# EAGLE schematic tempDAQ (EAGLE 8.3.0)

## Sheet 1 of 4
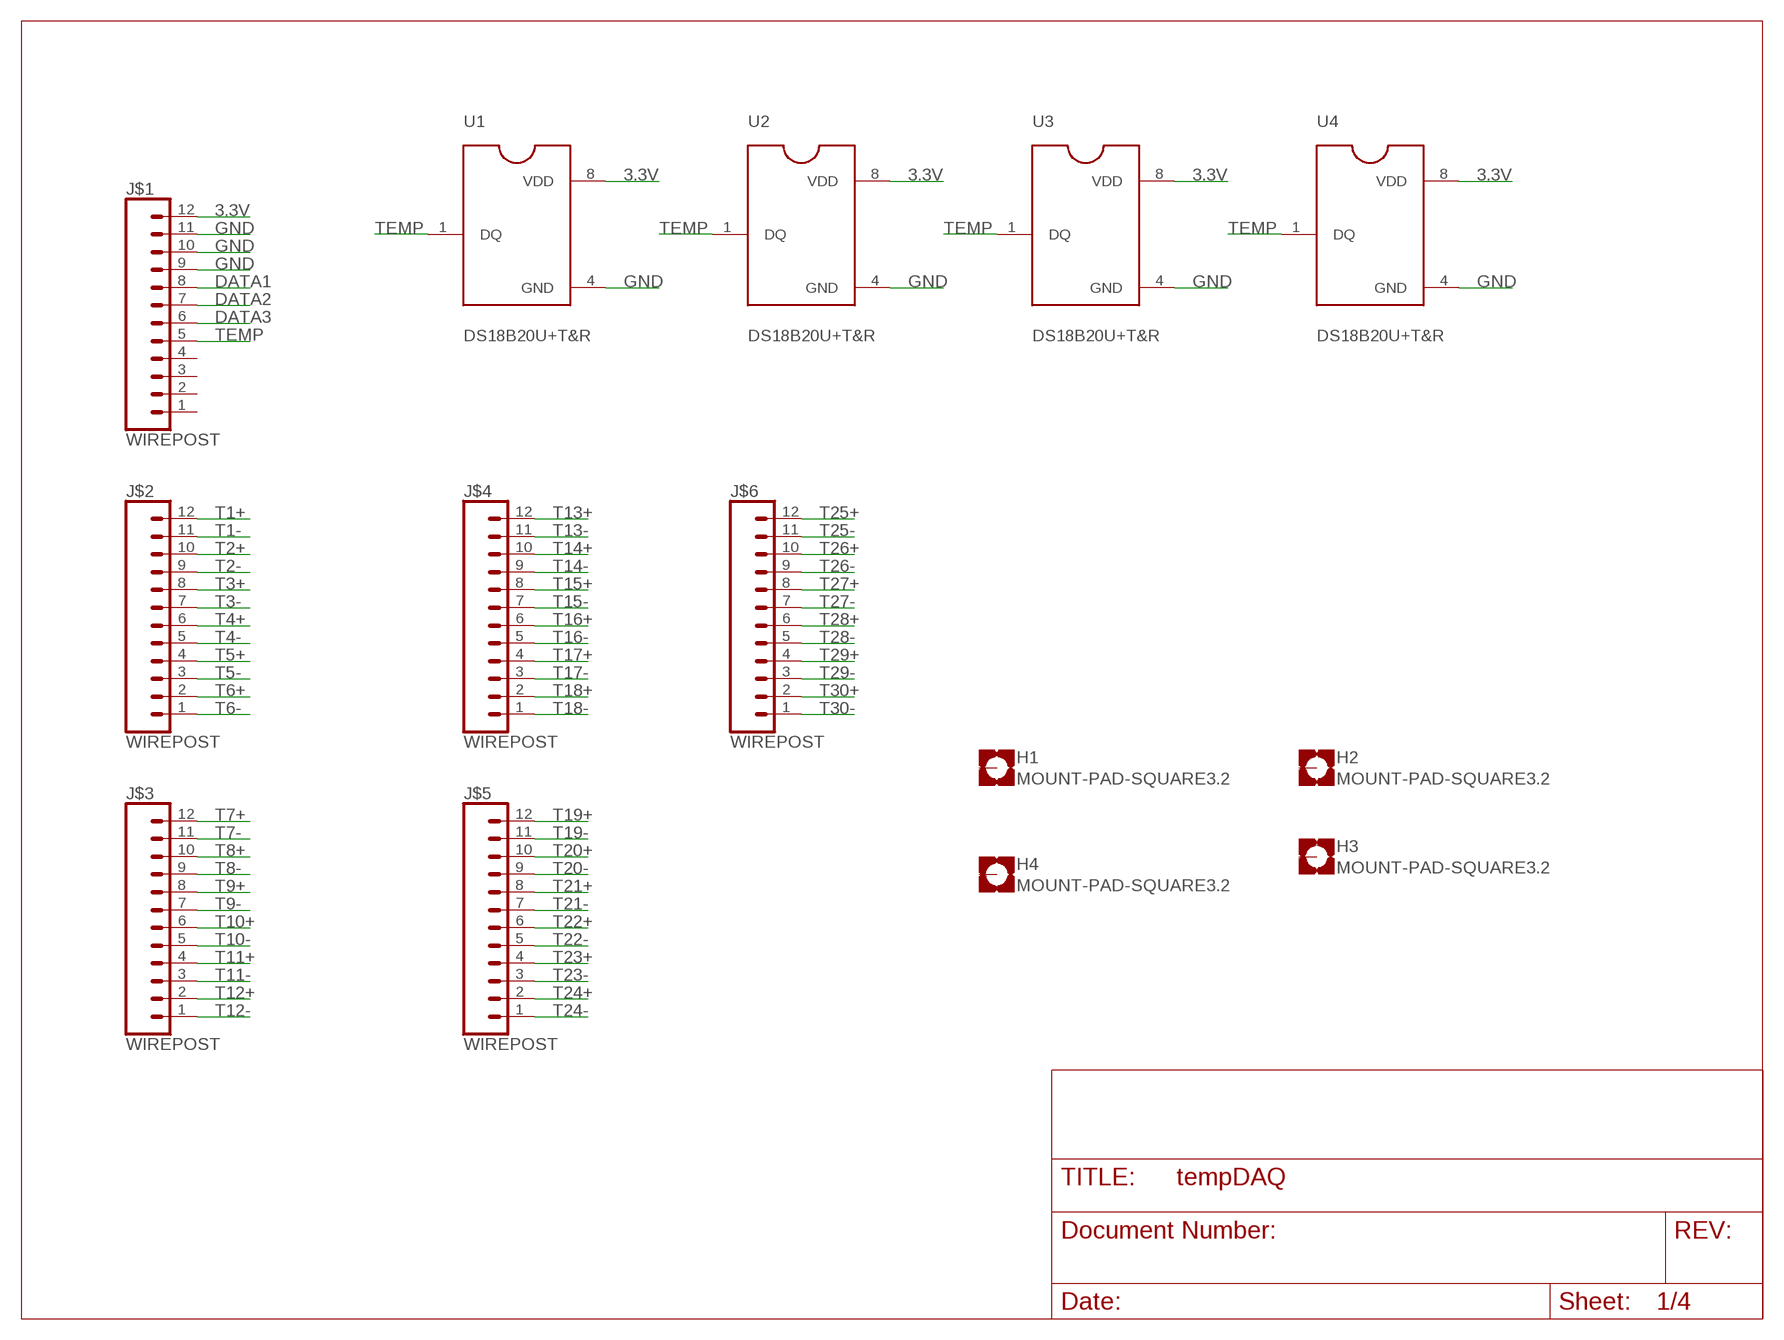
[diagram p0: schematic, sheet 1]

### Parts
H1  MOUNT-PAD-SQUARE3.2  [3,2-PAD-SQUARE]
H2  MOUNT-PAD-SQUARE3.2  [3,2-PAD-SQUARE]
H3  MOUNT-PAD-SQUARE3.2  [3,2-PAD-SQUARE]
H4  MOUNT-PAD-SQUARE3.2  [3,2-PAD-SQUARE]
J$1  WIREPOST  [WIREWRAPPOST]
J$2  WIREPOST  [WIREWRAPPOST]
J$3  WIREPOST  [WIREWRAPPOST]
J$4  WIREPOST  [WIREWRAPPOST]
J$5  WIREPOST  [WIREWRAPPOST]
J$6  WIREPOST  [WIREWRAPPOST]
U1  DS18B20U+T&R  [SOP65P500X110-8N]
U2  DS18B20U+T&R  [SOP65P500X110-8N]
U3  DS18B20U+T&R  [SOP65P500X110-8N]
U4  DS18B20U+T&R  [SOP65P500X110-8N]

### Nets
3.3V: J$1.12 U1.8(VDD) U2.8(VDD) U3.8(VDD) U4.8(VDD) ; also sheet 2,3,4
DATA1: J$1.8 ; also sheet 2
DATA2: J$1.7 ; also sheet 3
DATA3: J$1.6 ; also sheet 4
GND [gnd]: J$1.9 J$1.10 J$1.11 U1.4(GND) U2.4(GND) U3.4(GND) U4.4(GND) ; also sheet 2,3,4
T1+: J$2.12 ; also sheet 2
T1-: J$2.11 ; also sheet 2
T2+: J$2.10 ; also sheet 2
T2-: J$2.9 ; also sheet 2
T3+: J$2.8 ; also sheet 2
T3-: J$2.7 ; also sheet 2
T4+: J$2.6 ; also sheet 2
T4-: J$2.5 ; also sheet 2
T5+: J$2.4 ; also sheet 2
T5-: J$2.3 ; also sheet 2
T6+: J$2.2 ; also sheet 2
T6-: J$2.1 ; also sheet 2
T7+: J$3.12 ; also sheet 2
T7-: J$3.11 ; also sheet 2
T8+: J$3.10 ; also sheet 2
T8-: J$3.9 ; also sheet 2
T9+: J$3.8 ; also sheet 2
T9-: J$3.7 ; also sheet 2
T10+: J$3.6 ; also sheet 2
T10-: J$3.5 ; also sheet 2
T11+: J$3.4 ; also sheet 3
T11-: J$3.3 ; also sheet 3
T12+: J$3.2 ; also sheet 3
T12-: J$3.1 ; also sheet 3
T13+: J$4.12 ; also sheet 3
T13-: J$4.11 ; also sheet 3
T14+: J$4.10 ; also sheet 3
T14-: J$4.9 ; also sheet 3
T15+: J$4.8 ; also sheet 3
T15-: J$4.7 ; also sheet 3
T16+: J$4.6 ; also sheet 3
T16-: J$4.5 ; also sheet 3
T17+: J$4.4 ; also sheet 3
T17-: J$4.3 ; also sheet 3
T18+: J$4.2 ; also sheet 3
T18-: J$4.1 ; also sheet 3
T19+: J$5.12 ; also sheet 3
T19-: J$5.11 ; also sheet 3
T20+: J$5.10 ; also sheet 3
T20-: J$5.9 ; also sheet 3
T21+: J$5.8 ; also sheet 4
T21-: J$5.7 ; also sheet 4
T22+: J$5.6 ; also sheet 4
T22-: J$5.5 ; also sheet 4
T23+: J$5.4 ; also sheet 4
T23-: J$5.3 ; also sheet 4
T24+: J$5.2 ; also sheet 4
T24-: J$5.1 ; also sheet 4
T25+: J$6.12 ; also sheet 4
T25-: J$6.11 ; also sheet 4
T26+: J$6.10 ; also sheet 4
T26-: J$6.9 ; also sheet 4
T27+: J$6.8 ; also sheet 4
T27-: J$6.7 ; also sheet 4
T28+: J$6.6 ; also sheet 4
T28-: J$6.5 ; also sheet 4
T29+: J$6.4 ; also sheet 4
T29-: J$6.3 ; also sheet 4
T30+: J$6.2 ; also sheet 4
T30-: J$6.1 ; also sheet 4
TEMP: J$1.5 U1.1(DQ) U2.1(DQ) U3.1(DQ) U4.1(DQ)
Unconnected: H1.B3,2(MOUNT) H2.B3,2(MOUNT) H3.B3,2(MOUNT) H4.B3,2(MOUNT) J$1.1 J$1.2 J$1.3 J$1.4

## Sheet 2 of 4
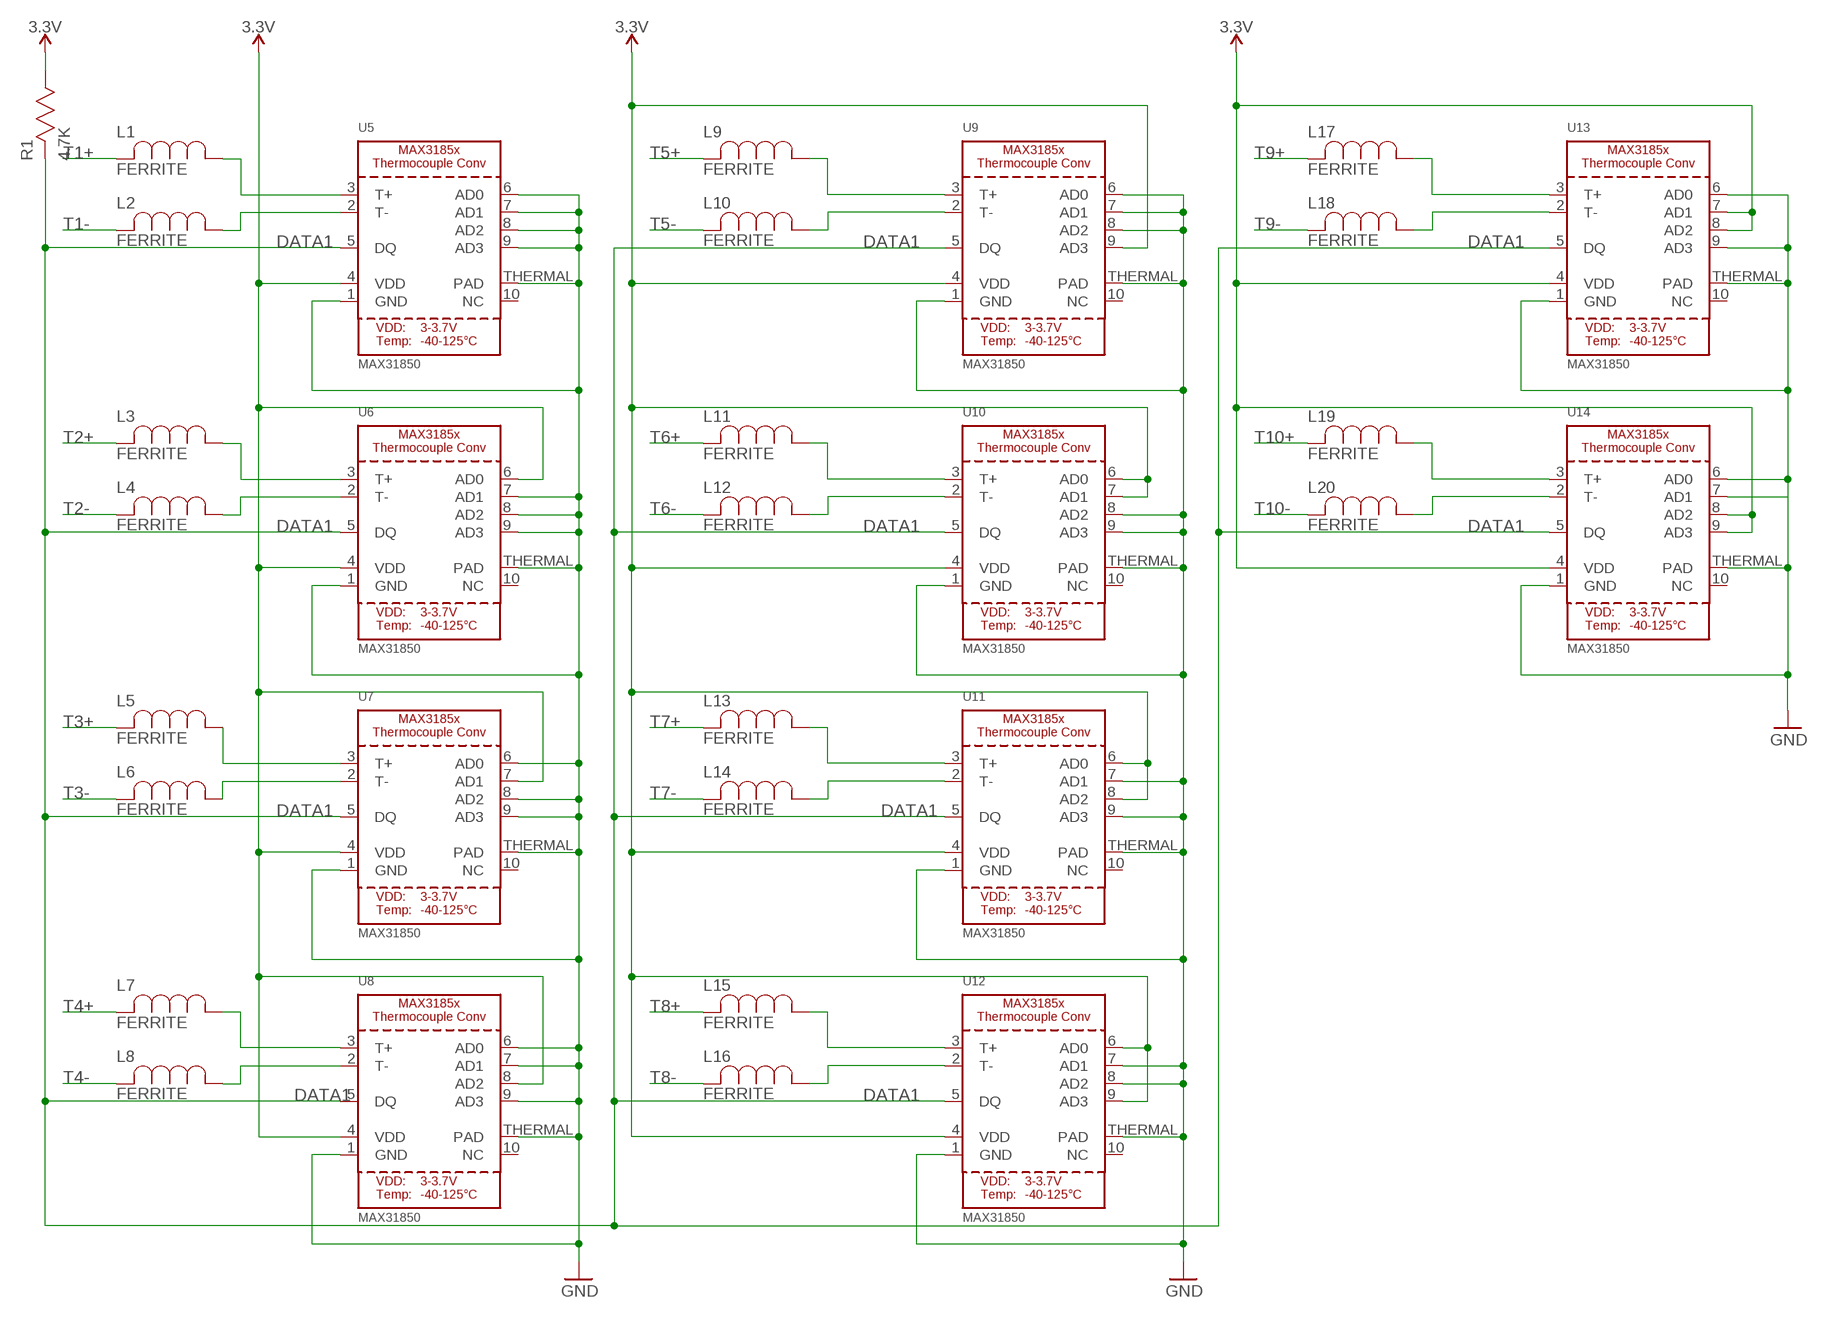
[diagram p1: schematic, sheet 2]

### Parts
L1  FERRITE  [IND_BOURNS_MH2029]
L2  FERRITE  [IND_BOURNS_MH2029]
L3  FERRITE  [IND_BOURNS_MH2029]
L4  FERRITE  [IND_BOURNS_MH2029]
L5  FERRITE  [IND_BOURNS_MH2029]
L6  FERRITE  [IND_BOURNS_MH2029]
L7  FERRITE  [IND_BOURNS_MH2029]
L8  FERRITE  [IND_BOURNS_MH2029]
L9  FERRITE  [IND_BOURNS_MH2029]
L10  FERRITE  [IND_BOURNS_MH2029]
L11  FERRITE  [IND_BOURNS_MH2029]
L12  FERRITE  [IND_BOURNS_MH2029]
L13  FERRITE  [IND_BOURNS_MH2029]
L14  FERRITE  [IND_BOURNS_MH2029]
L15  FERRITE  [IND_BOURNS_MH2029]
L16  FERRITE  [IND_BOURNS_MH2029]
L17  FERRITE  [IND_BOURNS_MH2029]
L18  FERRITE  [IND_BOURNS_MH2029]
L19  FERRITE  [IND_BOURNS_MH2029]
L20  FERRITE  [IND_BOURNS_MH2029]
R1  4.7K  RES_4_7K  [RC0603N]
U5  MAX31850  MAX3185X  [TDFN10_3X4MM]
U6  MAX31850  MAX3185X  [TDFN10_3X4MM]
U7  MAX31850  MAX3185X  [TDFN10_3X4MM]
U8  MAX31850  MAX3185X  [TDFN10_3X4MM]
U9  MAX31850  MAX3185X  [TDFN10_3X4MM]
U10  MAX31850  MAX3185X  [TDFN10_3X4MM]
U11  MAX31850  MAX3185X  [TDFN10_3X4MM]
U12  MAX31850  MAX3185X  [TDFN10_3X4MM]
U13  MAX31850  MAX3185X  [TDFN10_3X4MM]
U14  MAX31850  MAX3185X  [TDFN10_3X4MM]

### Nets
3.3V: R1.1 U5.4(VDD) U6.4(VDD) U6.6(AD0) U7.4(VDD) U7.7(AD1) U8.4(VDD) U8.8(AD2) U9.4(VDD) U9.9(AD3) U10.4(VDD) U10.6(AD0) U10.7(AD1) U11.4(VDD) U11.6(AD0) U11.8(AD2) U12.4(VDD) U12.6(AD0) U12.9(AD3) U13.4(VDD) U13.7(AD1) U13.8(AD2) U14.4(VDD) U14.8(AD2) U14.9(AD3) ; supply symbol labelled POWER_3.3V ; also sheet 1,3,4
DATA1: R1.2 U5.5(DQ) U6.5(DQ) U7.5(DQ) U8.5(DQ) U9.5(DQ) U10.5(DQ) U11.5(DQ) U12.5(DQ) U13.5(DQ) U14.5(DQ) ; also sheet 1
GND [gnd]: U5.1(GND) U5.6(AD0) U5.7(AD1) U5.8(AD2) U5.9(AD3) U5.THERMAL(PAD) U6.1(GND) U6.7(AD1) U6.8(AD2) U6.9(AD3) U6.THERMAL(PAD) U7.1(GND) U7.6(AD0) U7.8(AD2) U7.9(AD3) U7.THERMAL(PAD) U8.1(GND) U8.6(AD0) U8.7(AD1) U8.9(AD3) U8.THERMAL(PAD) U9.1(GND) U9.6(AD0) U9.7(AD1) U9.8(AD2) U9.THERMAL(PAD) U10.1(GND) U10.8(AD2) U10.9(AD3) U10.THERMAL(PAD) U11.1(GND) U11.7(AD1) U11.9(AD3) U11.THERMAL(PAD) U12.1(GND) U12.7(AD1) U12.8(AD2) U12.THERMAL(PAD) U13.1(GND) U13.6(AD0) U13.9(AD3) U13.THERMAL(PAD) U14.1(GND) U14.6(AD0) U14.7(AD1) U14.THERMAL(PAD) ; supply symbol labelled POWER_GND ; also sheet 1,3,4
N$17: L1.1 U5.3(T+)
N$22: L2.1 U5.2(T-)
N$23: L3.1 U6.3(T+)
N$24: L4.1 U6.2(T-)
N$25: L6.1 U7.2(T-)
N$26: L5.1 U7.3(T+)
N$27: L7.1 U8.3(T+)
N$28: L8.1 U8.2(T-)
N$29: L9.1 U9.3(T+)
N$30: L10.1 U9.2(T-)
N$31: L11.1 U10.3(T+)
N$32: L12.1 U10.2(T-)
N$33: L13.1 U11.3(T+)
N$34: L14.1 U11.2(T-)
N$35: L15.1 U12.3(T+)
N$36: L16.1 U12.2(T-)
N$37: L17.1 U13.3(T+)
N$38: L18.1 U13.2(T-)
N$39: L19.1 U14.3(T+)
N$40: L20.1 U14.2(T-)
T1+: L1.2 ; also sheet 1
T1-: L2.2 ; also sheet 1
T2+: L3.2 ; also sheet 1
T2-: L4.2 ; also sheet 1
T3+: L5.2 ; also sheet 1
T3-: L6.2 ; also sheet 1
T4+: L7.2 ; also sheet 1
T4-: L8.2 ; also sheet 1
T5+: L9.2 ; also sheet 1
T5-: L10.2 ; also sheet 1
T6+: L11.2 ; also sheet 1
T6-: L12.2 ; also sheet 1
T7+: L13.2 ; also sheet 1
T7-: L14.2 ; also sheet 1
T8+: L15.2 ; also sheet 1
T8-: L16.2 ; also sheet 1
T9+: L17.2 ; also sheet 1
T9-: L18.2 ; also sheet 1
T10+: L19.2 ; also sheet 1
T10-: L20.2 ; also sheet 1
Unconnected: U5.10(NC) U6.10(NC) U7.10(NC) U8.10(NC) U9.10(NC) U10.10(NC) U11.10(NC) U12.10(NC) U13.10(NC) U14.10(NC)

## Sheet 3 of 4
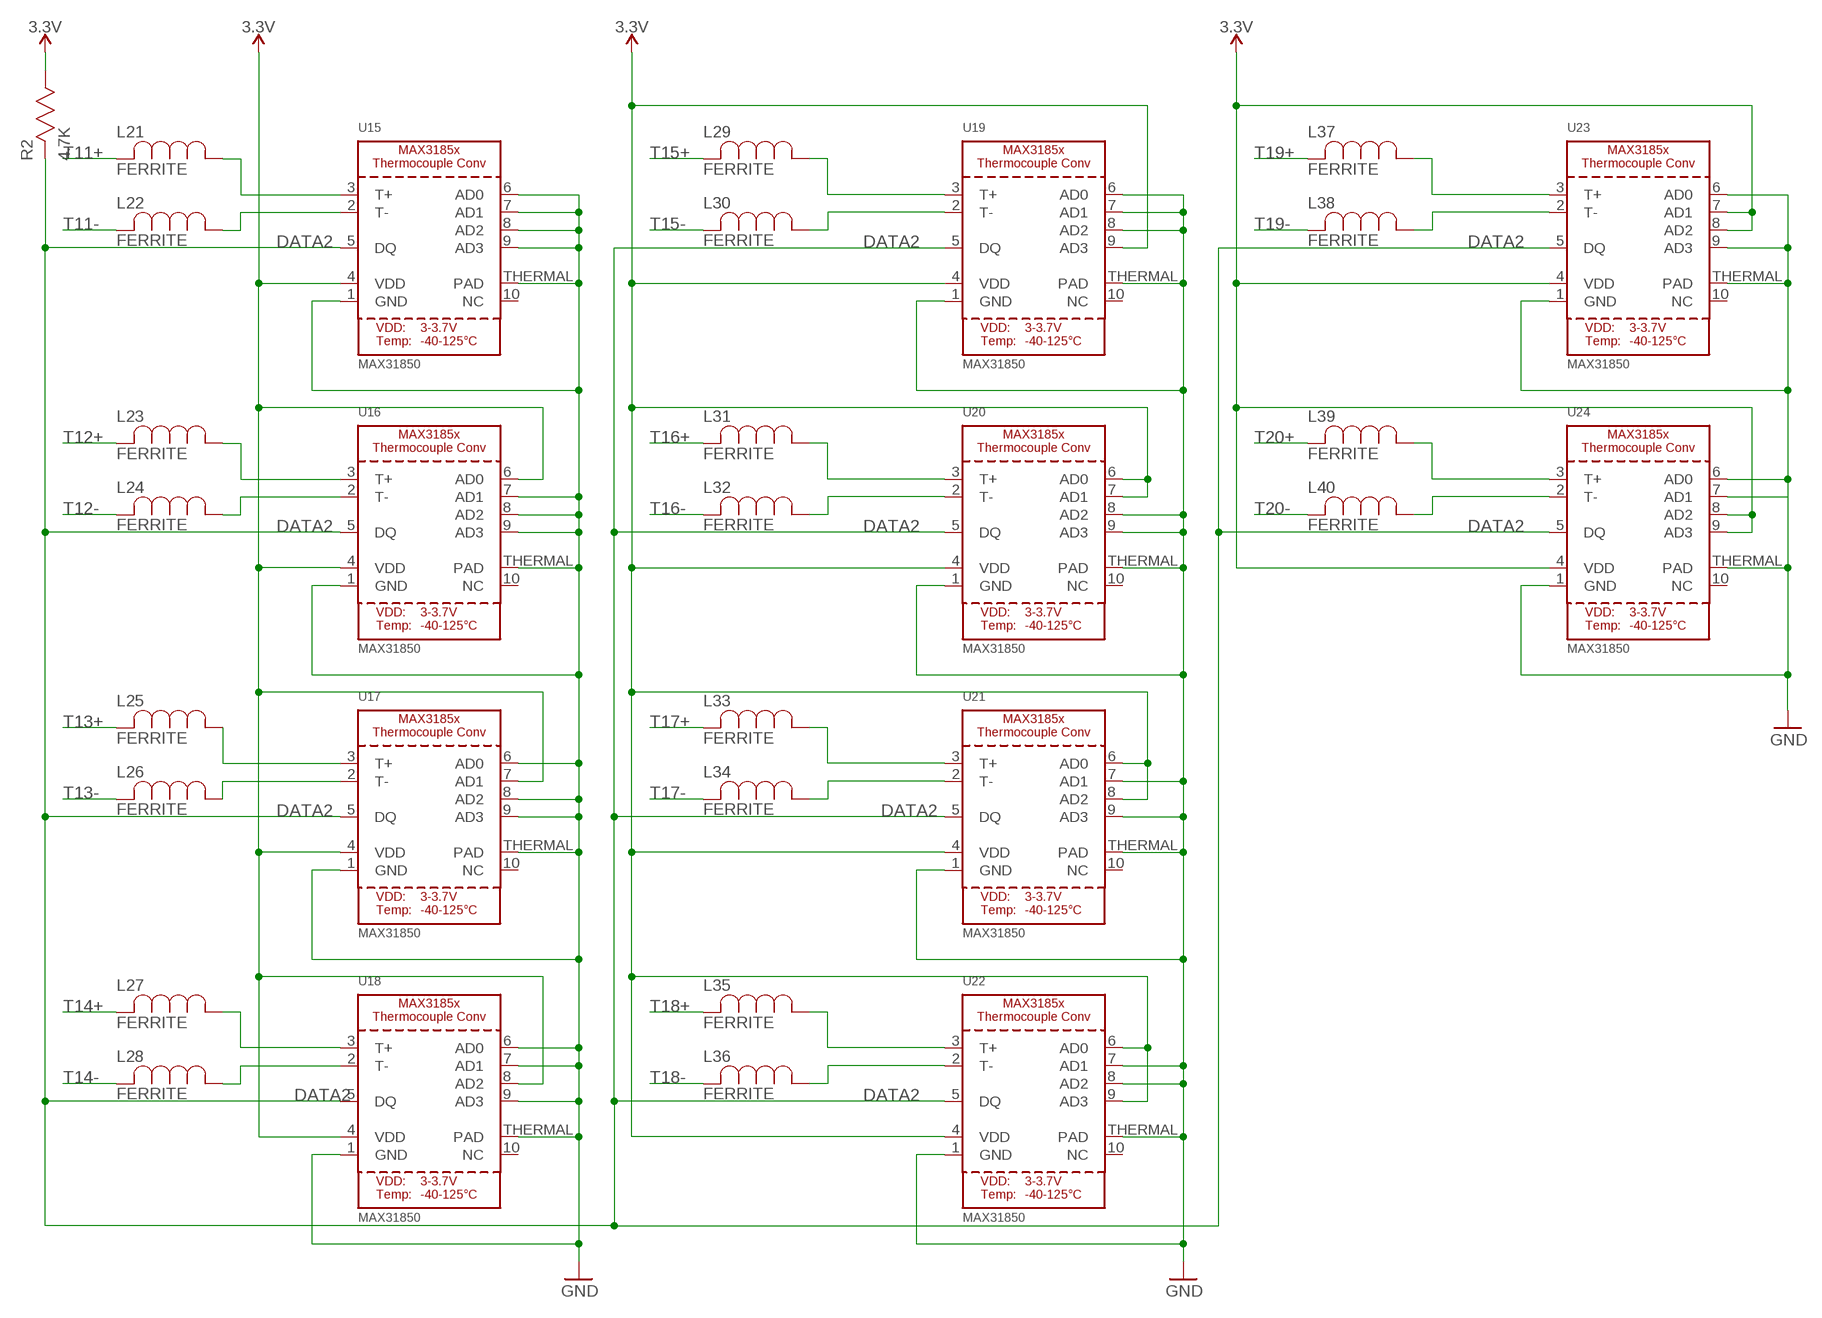
[diagram p2: schematic, sheet 3]

### Parts
L21  FERRITE  [IND_BOURNS_MH2029]
L22  FERRITE  [IND_BOURNS_MH2029]
L23  FERRITE  [IND_BOURNS_MH2029]
L24  FERRITE  [IND_BOURNS_MH2029]
L25  FERRITE  [IND_BOURNS_MH2029]
L26  FERRITE  [IND_BOURNS_MH2029]
L27  FERRITE  [IND_BOURNS_MH2029]
L28  FERRITE  [IND_BOURNS_MH2029]
L29  FERRITE  [IND_BOURNS_MH2029]
L30  FERRITE  [IND_BOURNS_MH2029]
L31  FERRITE  [IND_BOURNS_MH2029]
L32  FERRITE  [IND_BOURNS_MH2029]
L33  FERRITE  [IND_BOURNS_MH2029]
L34  FERRITE  [IND_BOURNS_MH2029]
L35  FERRITE  [IND_BOURNS_MH2029]
L36  FERRITE  [IND_BOURNS_MH2029]
L37  FERRITE  [IND_BOURNS_MH2029]
L38  FERRITE  [IND_BOURNS_MH2029]
L39  FERRITE  [IND_BOURNS_MH2029]
L40  FERRITE  [IND_BOURNS_MH2029]
R2  4.7K  RES_4_7K  [RC0603N]
U15  MAX31850  MAX3185X  [TDFN10_3X4MM]
U16  MAX31850  MAX3185X  [TDFN10_3X4MM]
U17  MAX31850  MAX3185X  [TDFN10_3X4MM]
U18  MAX31850  MAX3185X  [TDFN10_3X4MM]
U19  MAX31850  MAX3185X  [TDFN10_3X4MM]
U20  MAX31850  MAX3185X  [TDFN10_3X4MM]
U21  MAX31850  MAX3185X  [TDFN10_3X4MM]
U22  MAX31850  MAX3185X  [TDFN10_3X4MM]
U23  MAX31850  MAX3185X  [TDFN10_3X4MM]
U24  MAX31850  MAX3185X  [TDFN10_3X4MM]

### Nets
3.3V: R2.1 U15.4(VDD) U16.4(VDD) U16.6(AD0) U17.4(VDD) U17.7(AD1) U18.4(VDD) U18.8(AD2) U19.4(VDD) U19.9(AD3) U20.4(VDD) U20.6(AD0) U20.7(AD1) U21.4(VDD) U21.6(AD0) U21.8(AD2) U22.4(VDD) U22.6(AD0) U22.9(AD3) U23.4(VDD) U23.7(AD1) U23.8(AD2) U24.4(VDD) U24.8(AD2) U24.9(AD3) ; supply symbol labelled POWER_3.3V ; also sheet 1,2,4
DATA2: R2.2 U15.5(DQ) U16.5(DQ) U17.5(DQ) U18.5(DQ) U19.5(DQ) U20.5(DQ) U21.5(DQ) U22.5(DQ) U23.5(DQ) U24.5(DQ) ; also sheet 1
GND [gnd]: U15.1(GND) U15.6(AD0) U15.7(AD1) U15.8(AD2) U15.9(AD3) U15.THERMAL(PAD) U16.1(GND) U16.7(AD1) U16.8(AD2) U16.9(AD3) U16.THERMAL(PAD) U17.1(GND) U17.6(AD0) U17.8(AD2) U17.9(AD3) U17.THERMAL(PAD) U18.1(GND) U18.6(AD0) U18.7(AD1) U18.9(AD3) U18.THERMAL(PAD) U19.1(GND) U19.6(AD0) U19.7(AD1) U19.8(AD2) U19.THERMAL(PAD) U20.1(GND) U20.8(AD2) U20.9(AD3) U20.THERMAL(PAD) U21.1(GND) U21.7(AD1) U21.9(AD3) U21.THERMAL(PAD) U22.1(GND) U22.7(AD1) U22.8(AD2) U22.THERMAL(PAD) U23.1(GND) U23.6(AD0) U23.9(AD3) U23.THERMAL(PAD) U24.1(GND) U24.6(AD0) U24.7(AD1) U24.THERMAL(PAD) ; supply symbol labelled POWER_GND ; also sheet 1,2,4
N$1: L21.1 U15.3(T+)
N$2: L22.1 U15.2(T-)
N$3: L23.1 U16.3(T+)
N$4: L24.1 U16.2(T-)
N$5: L26.1 U17.2(T-)
N$6: L25.1 U17.3(T+)
N$7: L27.1 U18.3(T+)
N$8: L28.1 U18.2(T-)
N$9: L29.1 U19.3(T+)
N$10: L30.1 U19.2(T-)
N$11: L31.1 U20.3(T+)
N$12: L32.1 U20.2(T-)
N$13: L33.1 U21.3(T+)
N$14: L34.1 U21.2(T-)
N$15: L35.1 U22.3(T+)
N$16: L36.1 U22.2(T-)
N$18: L37.1 U23.3(T+)
N$19: L38.1 U23.2(T-)
N$20: L39.1 U24.3(T+)
N$21: L40.1 U24.2(T-)
T11+: L21.2 ; also sheet 1
T11-: L22.2 ; also sheet 1
T12+: L23.2 ; also sheet 1
T12-: L24.2 ; also sheet 1
T13+: L25.2 ; also sheet 1
T13-: L26.2 ; also sheet 1
T14+: L27.2 ; also sheet 1
T14-: L28.2 ; also sheet 1
T15+: L29.2 ; also sheet 1
T15-: L30.2 ; also sheet 1
T16+: L31.2 ; also sheet 1
T16-: L32.2 ; also sheet 1
T17+: L33.2 ; also sheet 1
T17-: L34.2 ; also sheet 1
T18+: L35.2 ; also sheet 1
T18-: L36.2 ; also sheet 1
T19+: L37.2 ; also sheet 1
T19-: L38.2 ; also sheet 1
T20+: L39.2 ; also sheet 1
T20-: L40.2 ; also sheet 1
Unconnected: U15.10(NC) U16.10(NC) U17.10(NC) U18.10(NC) U19.10(NC) U20.10(NC) U21.10(NC) U22.10(NC) U23.10(NC) U24.10(NC)

## Sheet 4 of 4
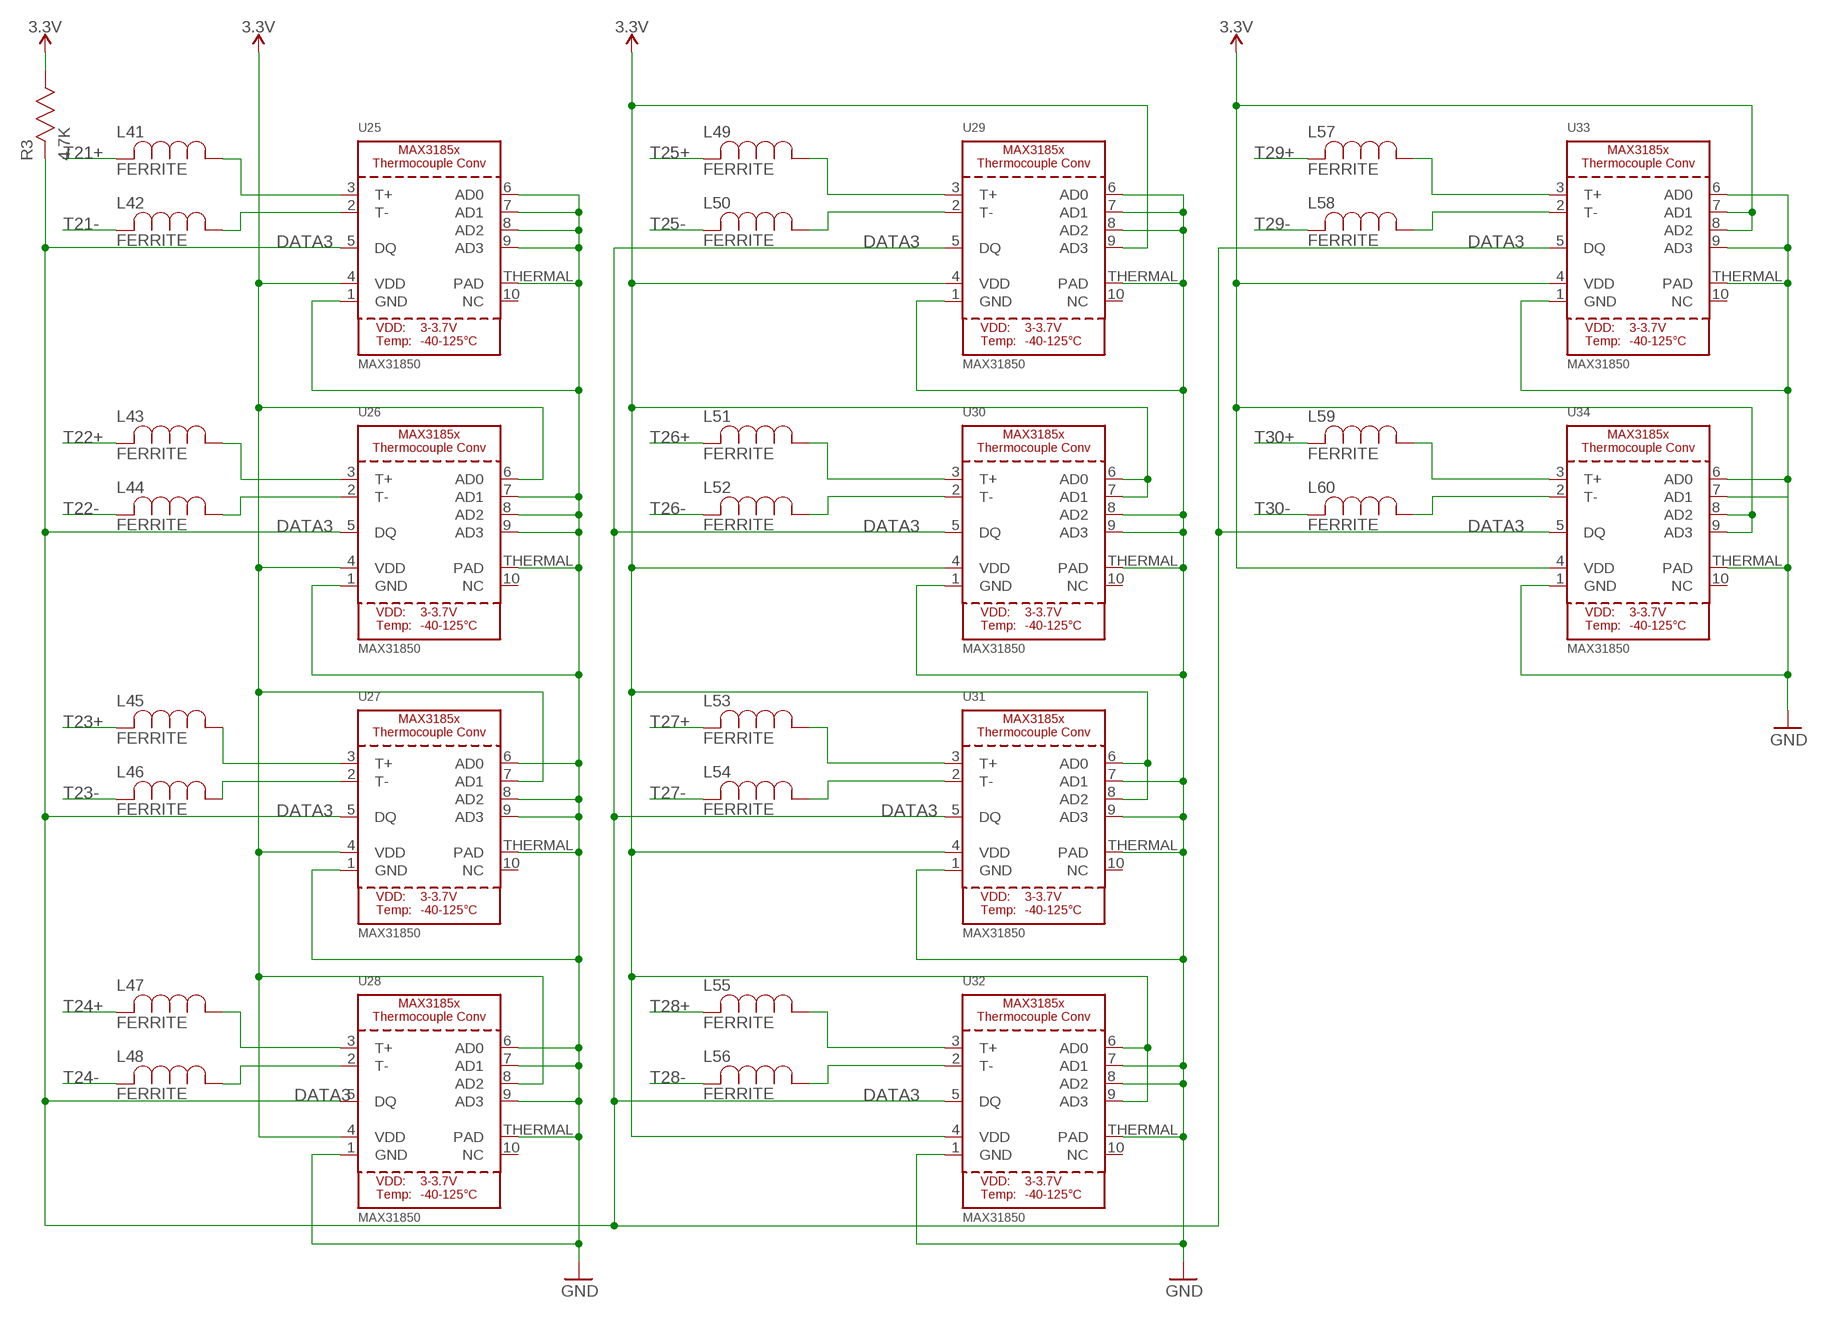
[diagram p3: schematic, sheet 4]

### Parts
L41  FERRITE  [IND_BOURNS_MH2029]
L42  FERRITE  [IND_BOURNS_MH2029]
L43  FERRITE  [IND_BOURNS_MH2029]
L44  FERRITE  [IND_BOURNS_MH2029]
L45  FERRITE  [IND_BOURNS_MH2029]
L46  FERRITE  [IND_BOURNS_MH2029]
L47  FERRITE  [IND_BOURNS_MH2029]
L48  FERRITE  [IND_BOURNS_MH2029]
L49  FERRITE  [IND_BOURNS_MH2029]
L50  FERRITE  [IND_BOURNS_MH2029]
L51  FERRITE  [IND_BOURNS_MH2029]
L52  FERRITE  [IND_BOURNS_MH2029]
L53  FERRITE  [IND_BOURNS_MH2029]
L54  FERRITE  [IND_BOURNS_MH2029]
L55  FERRITE  [IND_BOURNS_MH2029]
L56  FERRITE  [IND_BOURNS_MH2029]
L57  FERRITE  [IND_BOURNS_MH2029]
L58  FERRITE  [IND_BOURNS_MH2029]
L59  FERRITE  [IND_BOURNS_MH2029]
L60  FERRITE  [IND_BOURNS_MH2029]
R3  4.7K  RES_4_7K  [RC0603N]
U25  MAX31850  MAX3185X  [TDFN10_3X4MM]
U26  MAX31850  MAX3185X  [TDFN10_3X4MM]
U27  MAX31850  MAX3185X  [TDFN10_3X4MM]
U28  MAX31850  MAX3185X  [TDFN10_3X4MM]
U29  MAX31850  MAX3185X  [TDFN10_3X4MM]
U30  MAX31850  MAX3185X  [TDFN10_3X4MM]
U31  MAX31850  MAX3185X  [TDFN10_3X4MM]
U32  MAX31850  MAX3185X  [TDFN10_3X4MM]
U33  MAX31850  MAX3185X  [TDFN10_3X4MM]
U34  MAX31850  MAX3185X  [TDFN10_3X4MM]

### Nets
3.3V: R3.1 U25.4(VDD) U26.4(VDD) U26.6(AD0) U27.4(VDD) U27.7(AD1) U28.4(VDD) U28.8(AD2) U29.4(VDD) U29.9(AD3) U30.4(VDD) U30.6(AD0) U30.7(AD1) U31.4(VDD) U31.6(AD0) U31.8(AD2) U32.4(VDD) U32.6(AD0) U32.9(AD3) U33.4(VDD) U33.7(AD1) U33.8(AD2) U34.4(VDD) U34.8(AD2) U34.9(AD3) ; supply symbol labelled POWER_3.3V ; also sheet 1,2,3
DATA3: R3.2 U25.5(DQ) U26.5(DQ) U27.5(DQ) U28.5(DQ) U29.5(DQ) U30.5(DQ) U31.5(DQ) U32.5(DQ) U33.5(DQ) U34.5(DQ) ; also sheet 1
GND [gnd]: U25.1(GND) U25.6(AD0) U25.7(AD1) U25.8(AD2) U25.9(AD3) U25.THERMAL(PAD) U26.1(GND) U26.7(AD1) U26.8(AD2) U26.9(AD3) U26.THERMAL(PAD) U27.1(GND) U27.6(AD0) U27.8(AD2) U27.9(AD3) U27.THERMAL(PAD) U28.1(GND) U28.6(AD0) U28.7(AD1) U28.9(AD3) U28.THERMAL(PAD) U29.1(GND) U29.6(AD0) U29.7(AD1) U29.8(AD2) U29.THERMAL(PAD) U30.1(GND) U30.8(AD2) U30.9(AD3) U30.THERMAL(PAD) U31.1(GND) U31.7(AD1) U31.9(AD3) U31.THERMAL(PAD) U32.1(GND) U32.7(AD1) U32.8(AD2) U32.THERMAL(PAD) U33.1(GND) U33.6(AD0) U33.9(AD3) U33.THERMAL(PAD) U34.1(GND) U34.6(AD0) U34.7(AD1) U34.THERMAL(PAD) ; supply symbol labelled POWER_GND ; also sheet 1,2,3
N$41: L41.1 U25.3(T+)
N$42: L42.1 U25.2(T-)
N$43: L43.1 U26.3(T+)
N$44: L44.1 U26.2(T-)
N$45: L46.1 U27.2(T-)
N$46: L45.1 U27.3(T+)
N$47: L47.1 U28.3(T+)
N$48: L48.1 U28.2(T-)
N$49: L49.1 U29.3(T+)
N$50: L50.1 U29.2(T-)
N$51: L51.1 U30.3(T+)
N$52: L52.1 U30.2(T-)
N$53: L53.1 U31.3(T+)
N$54: L54.1 U31.2(T-)
N$55: L55.1 U32.3(T+)
N$56: L56.1 U32.2(T-)
N$57: L57.1 U33.3(T+)
N$58: L58.1 U33.2(T-)
N$59: L59.1 U34.3(T+)
N$60: L60.1 U34.2(T-)
T21+: L41.2 ; also sheet 1
T21-: L42.2 ; also sheet 1
T22+: L43.2 ; also sheet 1
T22-: L44.2 ; also sheet 1
T23+: L45.2 ; also sheet 1
T23-: L46.2 ; also sheet 1
T24+: L47.2 ; also sheet 1
T24-: L48.2 ; also sheet 1
T25+: L49.2 ; also sheet 1
T25-: L50.2 ; also sheet 1
T26+: L51.2 ; also sheet 1
T26-: L52.2 ; also sheet 1
T27+: L53.2 ; also sheet 1
T27-: L54.2 ; also sheet 1
T28+: L55.2 ; also sheet 1
T28-: L56.2 ; also sheet 1
T29+: L57.2 ; also sheet 1
T29-: L58.2 ; also sheet 1
T30+: L59.2 ; also sheet 1
T30-: L60.2 ; also sheet 1
Unconnected: U25.10(NC) U26.10(NC) U27.10(NC) U28.10(NC) U29.10(NC) U30.10(NC) U31.10(NC) U32.10(NC) U33.10(NC) U34.10(NC)

## Library data of the parts
H1-H4 = holes:MOUNT-PAD-SQUARE: MOUNTING PAD, square
J$1-J$6 = cubesat:WIREPOST
L1-L60 = cubesat_:FERRITE: Digikey MH2029-300YCT-ND; MANUFACTURER_PART_NUMBER: MH2029300Y; VENDOR: Bourns Electronics
R1-R3 = cubesat_:RES_4_7K: Digikey 311-4.7KGRCT-ND
U1-U4 = cubesat_:DS18B20U+T&R: Programmable Resolution 1-Wire Digital Thermometer; AVAILABILITY: Good; DESCRIPTION: Temp Sensor Digital Serial (1-Wire) 8-Pin uMAX T/R; MF: Maxim Integrated; MP: DS18B20U+T&amp;R; PACKAGE: MSOP-8 Maxim Integrated; PRICE: 2.79 USD
U5-U34 = microbuilder:MAX3185X: MAX31850/MAX31851 One-Wire Thermocouple to Digital Converter

## Net classes
1 power: width 0.61 mm, drill 0.406 mm, clearance 0.205 mm to class 0, clearance 0.205 mm
2 gnd: width 0.305 mm, drill 0.406 mm, clearance 0.205 mm to class 0, clearance 0.205 mm to class 1, clearance 0.205 mm
3 power usb: width 0.508 mm, drill 0.406 mm, clearance 0.205 mm to class 0, clearance 0.205 mm to class 1, clearance 0.205 mm to class 2, clearance 0.205 mm